# EAGLE design Seeeduino-Stalker-v3.0 (EAGLE 6.4)
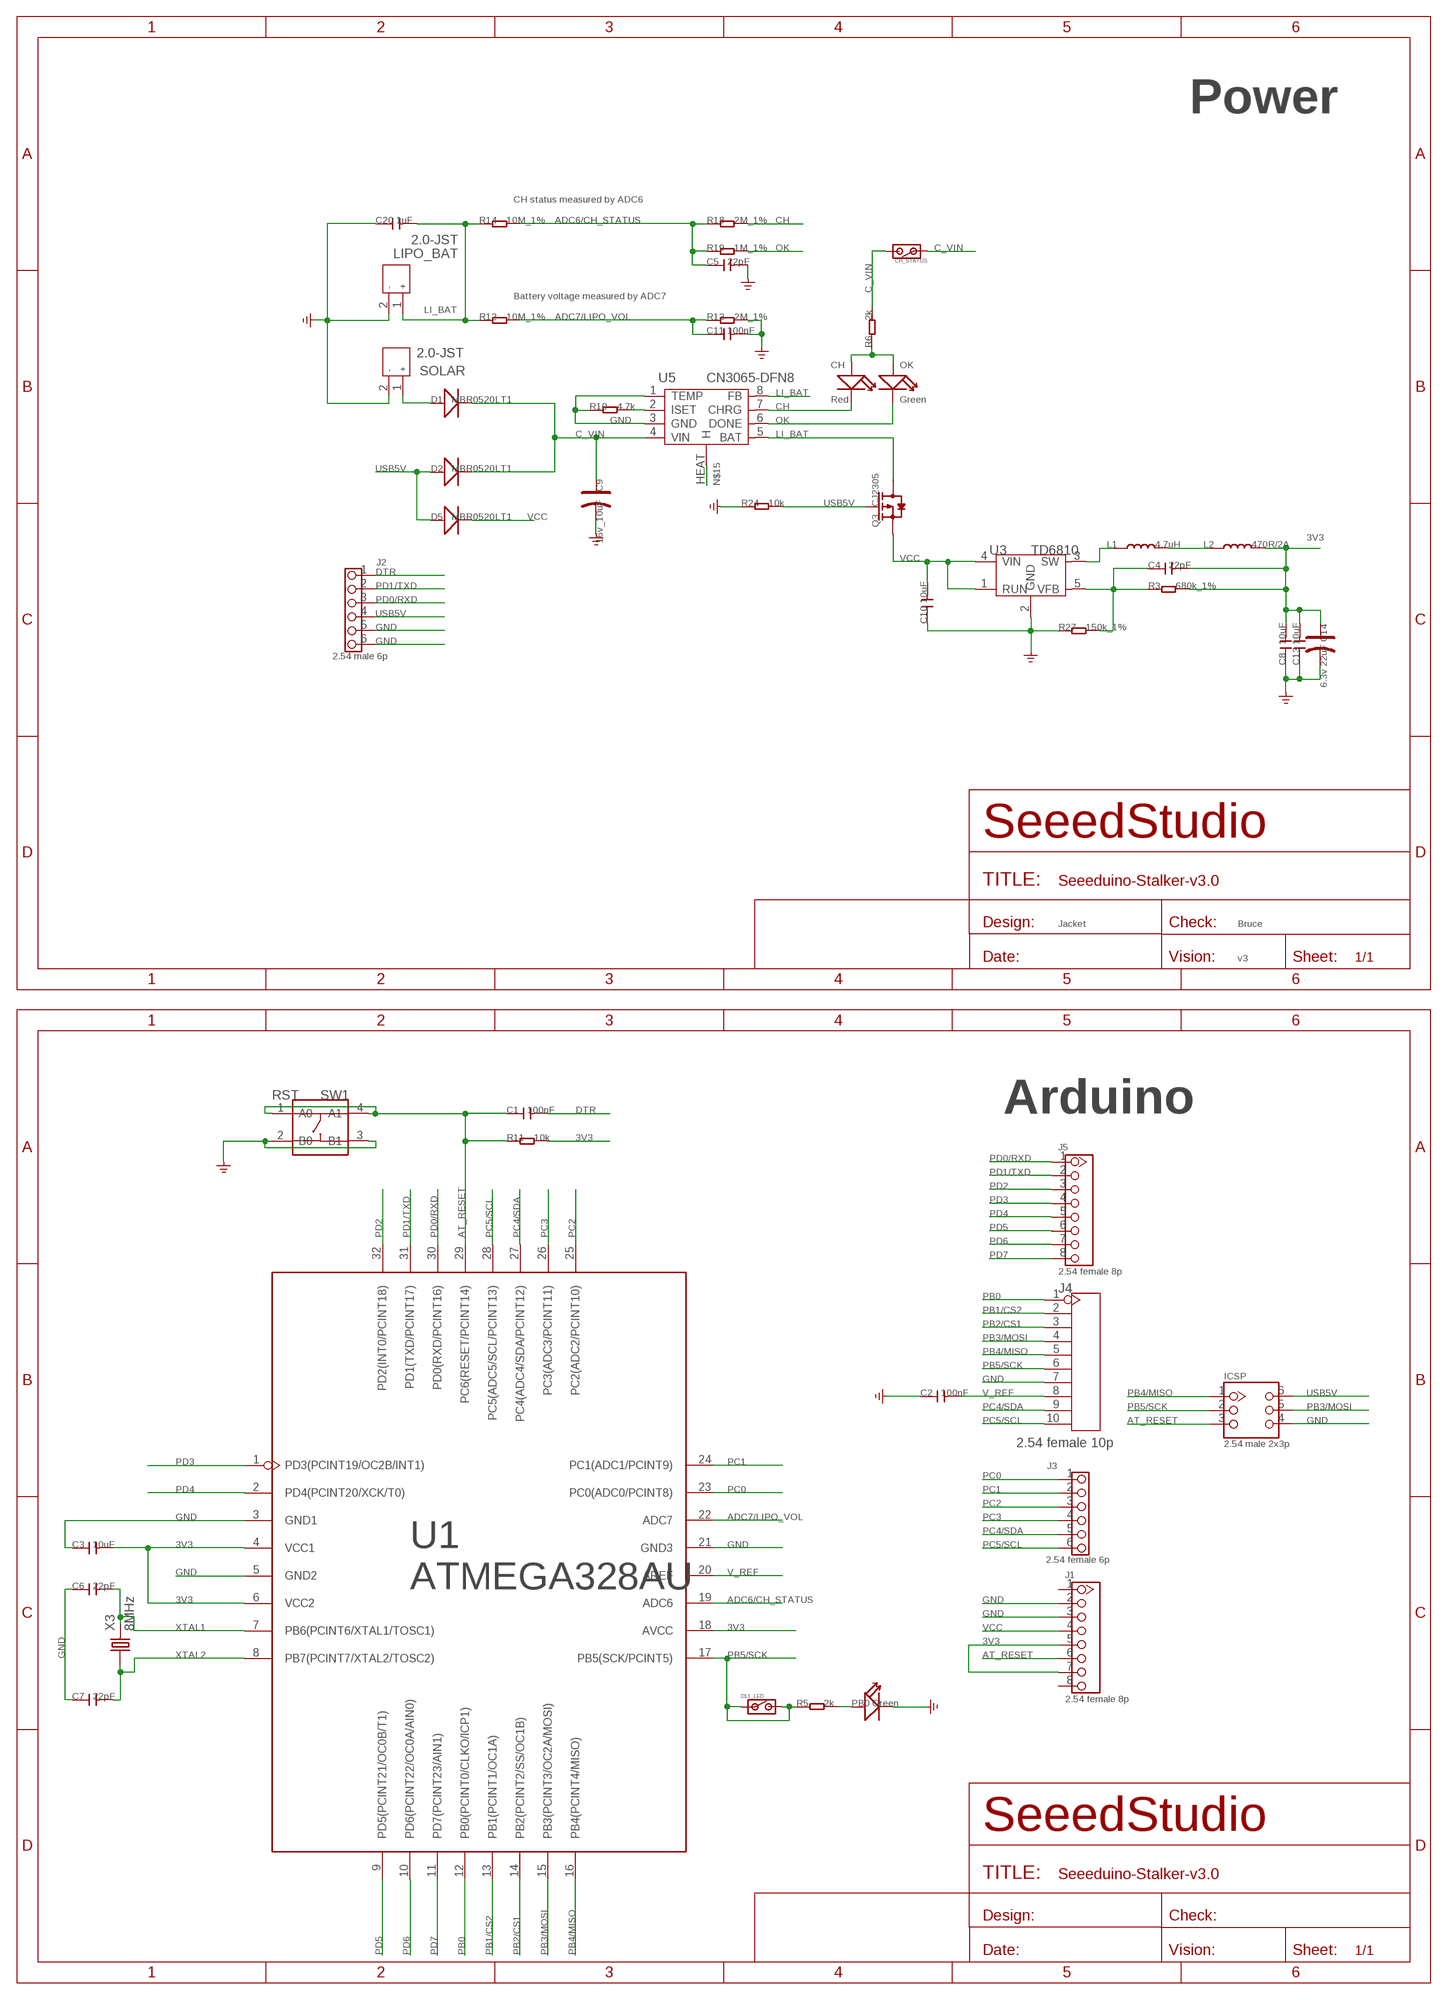
[diagram p0: schematic, sheet 1, part 1 of 2]
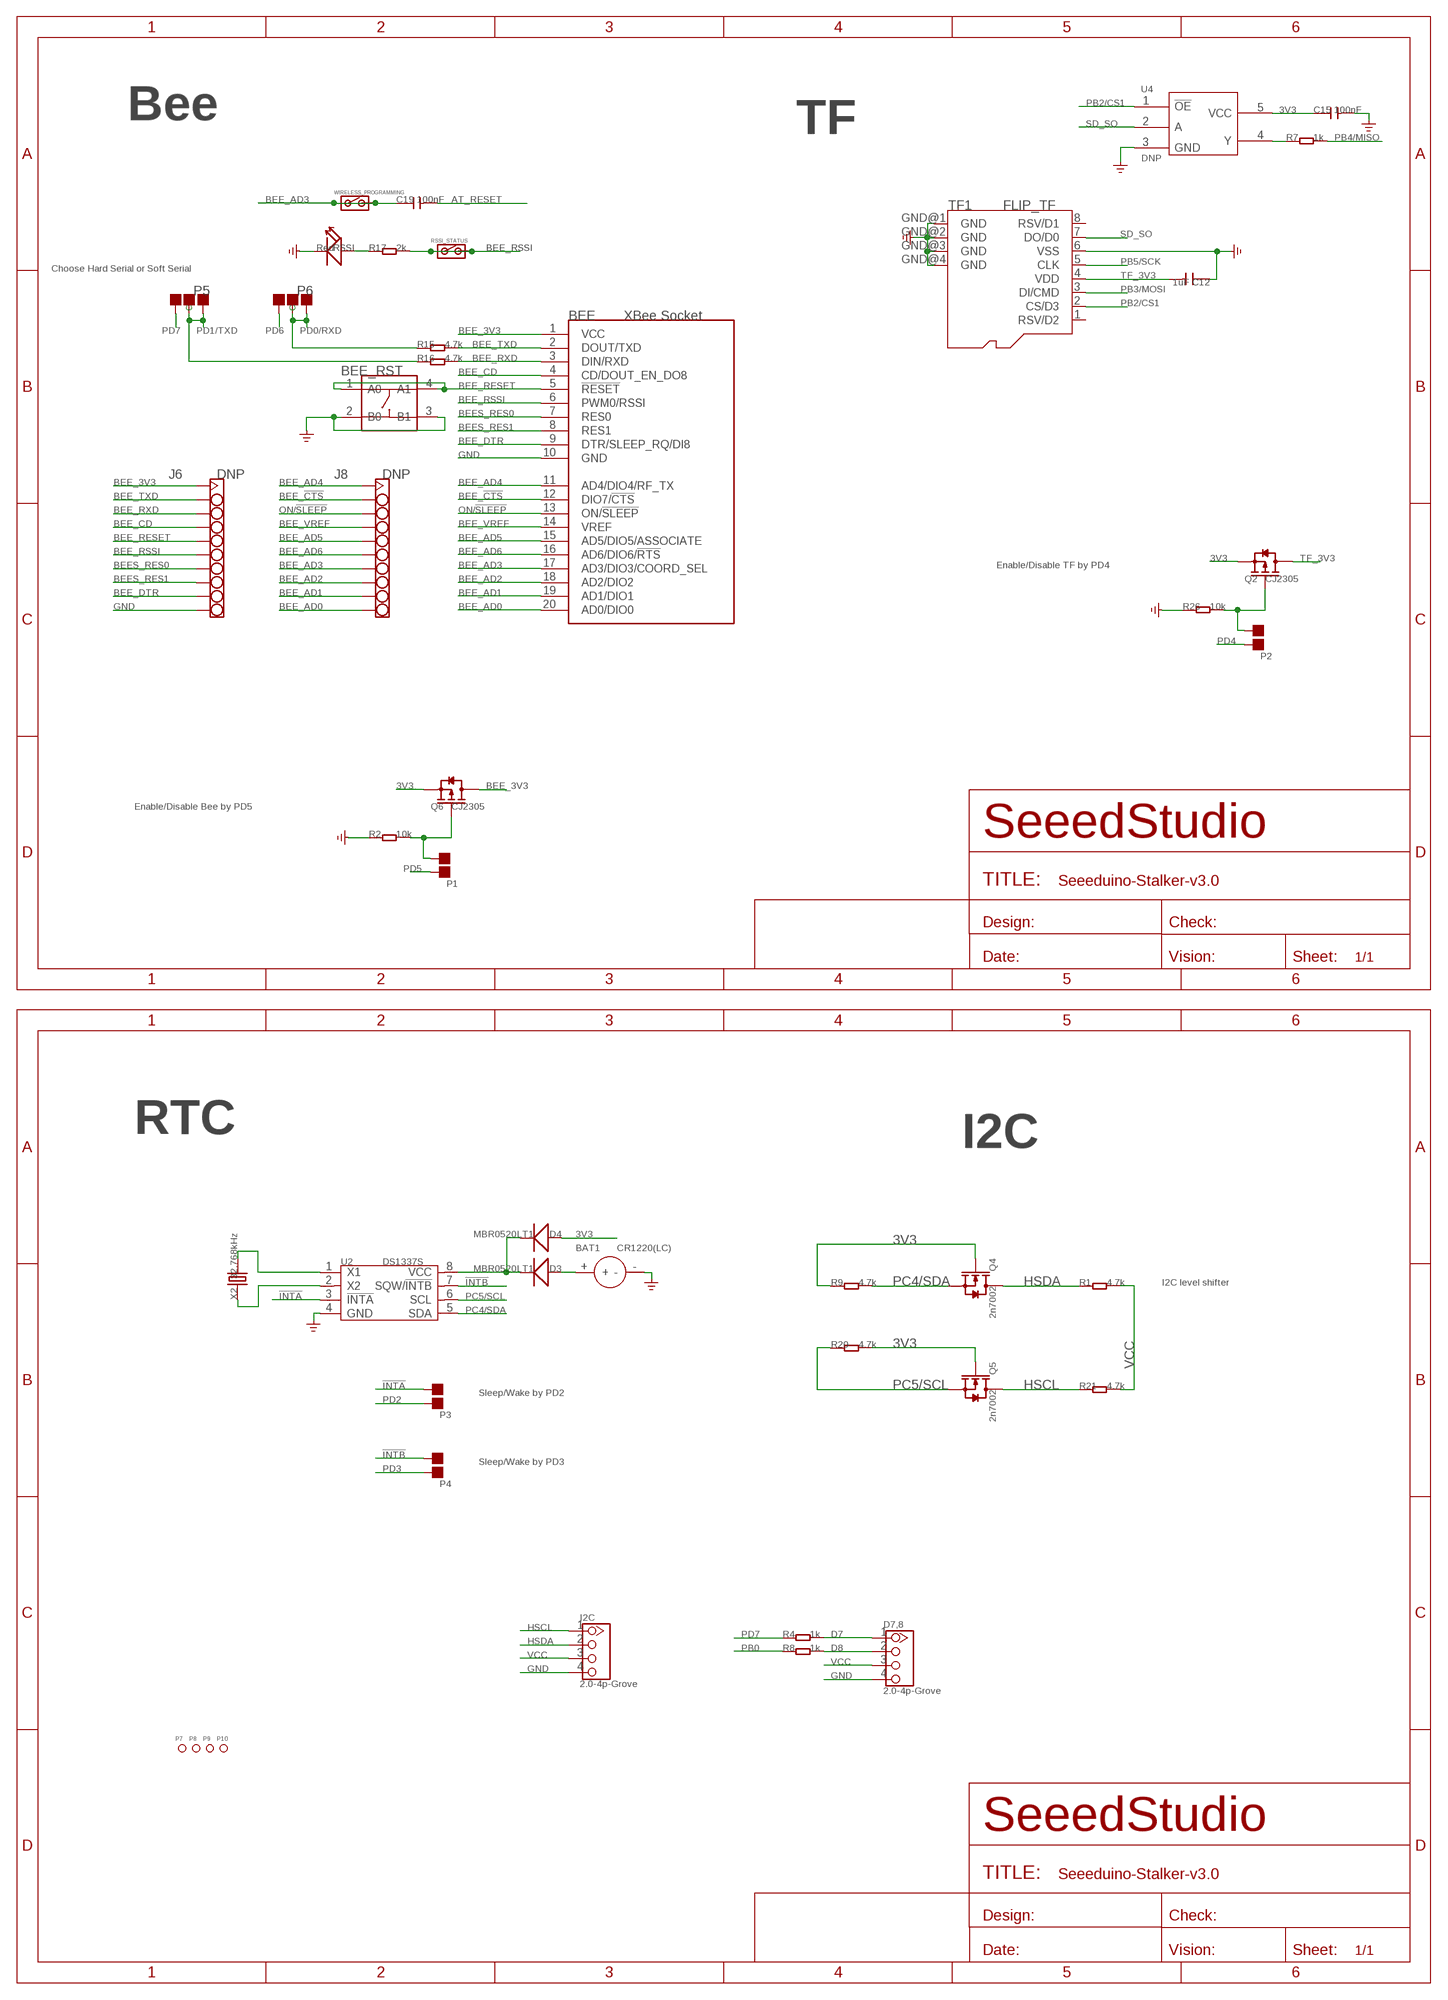
[diagram p1: schematic, sheet 1, part 2 of 2]

## Parts
BAT1  CR1220(LC)  BATTERY-3V  [2P-D12.55X2.22H]
BEE  XBee Socket  BEEO  [BEE]
BEE_RST  SW2  BUTTON-4P-6X6-SMD  [4P-SMD-6.2X6.2X4H]
C1  100nF  C-0603  [C0603]
C2  100nF  C-0603  [C0603]
C3  10uF  C-0805  [C0805]
C4  22pF  C-0603  [C0603]
C5  22pF  C-0603  [C0603]
C6  22pF  C-0603  [C0603]
C7  22pF  C-0603  [C0603]
C8  10uF  C-0805  [C0805]
C9  16v_10uF  CAP-AVX-A  [AVX-A]
C10  10uF  C-0805  [C0805]
C11  100nF  C-0603  [C0603]
C12  1uF  C-0805  [C0805]
C13  10uF  C-0805  [C0805]
C14  6.3v 22uF  CAP-AVX-A  [AVX-A]
C15  100nF  C-0603  [C0603]
C19  100nF  C-0603  [C0603]
C20  1uF  C-0805  [C0805]
CH  Red  007-LED0603  [D0603]
CH_STATUS  DNP  JP_SW  [JP_SW]
D1  MBR0520LT1  D'MBR0520LT1'  [SOD123-2.7X1.6]
D2  MBR0520LT1  D'MBR0520LT1'  [SOD123-2.7X1.6]
D3  MBR0520LT1  D'MBR0520LT1'  [SOD123-2.7X1.6]
D4  MBR0520LT1  D'MBR0520LT1'  [SOD123-2.7X1.6]
D5  MBR0520LT1  D'MBR0520LT1'  [SOD123-2.7X1.6]
D7,8  2.0-4p-Grove  TWIG-4P-2.0-2.0  [4P-2.0]
D13_LED  DNP  JP_SW  [JP_SW]
I2C  2.0-4p-Grove  TWIG-4P-2.0-2.0  [4P-2.0]
ICSP  2.54 male 2x3p  HEADER-2X3P-2.54  [2X3P-2.54-LEADED]
J1  2.54 female 8p  HEADER-8P-2.54-LEADED  [8P-2.54-LEADED]
J2  2.54 male 6p  HEADER-6P-LEADED-2.54  [6P-2.54-LEADED]
J3  2.54 female 6p  HEADER-6P-LEADED-2.54  [6P-2.54-LEADED]
J4  2.54 female 10p  HEADER-10P-2.54  [10P-2.54]
J5  2.54 female 8p  HEADER-8P-2.54-LEADED  [8P-2.54-LEADED]
J6  DNP  HEADER_1X10DD  [HEADER_1X10]
J8  DNP  HEADER_1X10DD  [HEADER_1X10]
L1  4.7uH  LSPD3D16-4R7M  [L0420]
L2  470R/2A  L'0805'  [L0805]
LIPO_BAT  2.0-JST  JACK-JST-2P-PW'2.0'  [JST-2.0]
OK  Green  007-LED0603  [D0603]
P1  DNP  PAD-JUMPER-2P  [2P-SMD-1.78X1.27]
P2  DNP  PAD-JUMPER-2P  [2P-SMD-1.78X1.27]
P3  DNP  PAD-JUMPER-2P  [2P-SMD-1.78X1.27]
P4  DNP  PAD-JUMPER-2P  [2P-SMD-1.78X1.27]
P5  DNP  PAD-JUMPER-3P-40*40  [3P-SMD-4.1X1.5]
P6  DNP  PAD-JUMPER-3P-40*40  [3P-SMD-4.1X1.5]
P7  PAD-MARK  [ROUND-MARK-1.0]
P8  PAD-MARK  [ROUND-MARK-1.0]
P9  PAD-MARK  [ROUND-MARK-1.0]
P10  PAD-MARK  [ROUND-MARK-1.0]
PB0  Green  007-LED0603  [D0603]
Q2  CJ2305  MOSFET-P'SI2323CDS/SI2305DS<BR>'  [SOT23]
Q3  CJ2305  MOSFET-P'SI2323CDS/SI2305DS<BR>'  [SOT23]
Q4  2n7002  MOSFET-N'SOT23'  [SOT23]
Q5  2n7002  MOSFET-N'SOT23'  [SOT23]
Q6  CJ2305  MOSFET-P'SI2323CDS/SI2305DS<BR>'  [SOT23]
R1  4.7k  005-R0603  [0603@1]
R2  10k  005-R0603  [0603@1]
R3  680k_1%  005-R0603  [0603@1]
R4  1k  005-R0603  [0603@1]
R5  2k  005-R0603  [0603@1]
R6  2k  005-R0603  [0603@1]
R7  1k  005-R0603  [0603@1]
R8  1k  005-R0603  [0603@1]
R9  4.7k  005-R0603  [0603@1]
R10  4.7k  005-R0603  [0603@1]
R11  10k  005-R0603  [0603@1]
R12  10M_1%  005-R0603  [0603@1]
R13  2M_1%  005-R0603  [0603@1]
R14  10M_1%  005-R0603  [0603@1]
R15  4.7k  005-R0603  [0603@1]
R16  4.7k  005-R0603  [0603@1]
R17  2k  005-R0603  [0603@1]
R18  2M_1%  005-R0603  [0603@1]
R19  1M_1%  005-R0603  [0603@1]
R20  4.7k  005-R0603  [0603@1]
R21  4.7k  005-R0603  [0603@1]
R24  10k  005-R0603  [0603@1]
R26  10k  005-R0603  [0603@1]
R27  150k_1%  005-R0603  [0603@1]
RSSI  Red  007-LED0603  [D0603]
RSSI_STATUS  DNP  JP_SW  [JP_SW]
RST  SW1  BUTTON-4P-6X6-SMD  [4P-SMD-6.2X6.2X4H]
SOLAR  2.0-JST  JACK-JST-2P-PW'2.0'  [JST-2.0]
TF1  FLIP_TF  [FLIP_TF]
U1  ATMEGA328AU  ATMEGA168-20AU  [ATMEGA168-20AU]
U2  DS1337S  [SOP8]
U3  TD6810  TD6810'TSOT23-5'  [SOT23-5]
U4  DNP  SN74LVC1G125DCKR  [SOT353]
U5  CN3065-DFN8  [DFN8]
WIRELESS_PROGRAMMING  DNP  JP_SW  [JP_SW]
X2  32.768kHz  CRYSTAL-3215  [2P-SMD-3.2X1.5]
X3  8MHz  011-CRYSTALHC49S  [HC49/S]

## Nets
3V3: C3.2 C4.2 C8.2 C13.2 C14.+ C15.1 D4.1(+) J1.5 J1.7 L2.2 Q2.2(S) Q4.1(G) Q5.1(G) Q6.2(S) R3.2 R9.1 R11.2 R20.2 U1.4(VCC1) U1.6(VCC2) U1.18(AVCC) U4.5(VCC)
!INTA: P3.1 U2.3(!INTA)
!INTB: P4.1 U2.7(SQW/!INTB)
ADC6/CH_STATUS: C5.1 R14.2 R18.1 R19.1 U1.19(ADC6)
ADC7/LIPO_VOL: C11.1 R12.2 R13.1 U1.22(ADC7)
AT_RESET: C1.1 C19.2 ICSP.3 J1.6 R11.1 RST.1(A0) RST.4(A1) U1.29(PC6(RESET/PCINT14))
BEE_3V3: BEE.1(VCC) J6.1 Q6.3(D)
BEE_!CTS: BEE.12(DIO7/!CTS) J8.2
BEE_AD0: BEE.20(AD0/DIO0) J8.10
BEE_AD1: BEE.19(AD1/DIO1) J8.9
BEE_AD2: BEE.18(AD2/DIO2) J8.8
BEE_AD3: BEE.17(AD3/DIO3/COORD_SEL) C19.1 J8.7 WIRELESS_PROGRAMMING.1 WIRELESS_PROGRAMMING.2
BEE_AD4: BEE.11(AD4/DIO4/RF_TX) J8.1
BEE_AD5: BEE.15(AD5/DIO5/ASSOCIATE) J8.5
BEE_AD6: BEE.16(AD6/DIO6/!RTS) J8.6
BEE_CD: BEE.4(CD/DOUT_EN_DO8) J6.4
BEE_DTR: BEE.9(DTR/SLEEP_RQ/DI8) J6.9
BEE_RESET: BEE.5(!RESET) BEE_RST.1(A0) BEE_RST.4(A1) J6.5
BEE_RSSI: BEE.6(PWM0/RSSI) J6.6 R17.2 RSSI_STATUS.1 RSSI_STATUS.2
BEE_RXD: BEE.3(DIN/RXD) J6.3 R16.2
BEE_TXD: BEE.2(DOUT/TXD) J6.2 R15.2
BEE_VREF: BEE.14(VREF) J8.4
BEES_RES0: BEE.7(RES0) J6.7
BEES_RES1: BEE.8(RES1) J6.8
C_VIN: C9.+ CH_STATUS.1 CH_STATUS.2 D1.2(-) D2.2(-) R6.2 U5.4(VIN)
CH: CH.- R18.2 U5.7(CHRG)
D7: D7,8.1 R4.2
D8: D7,8.2 R8.2
DTR: C1.2 J2.1
GND: BAT1.- BEE.10(GND) BEE_RST.2(B0) BEE_RST.3(B1) C2.1 C3.1 C5.2 C6.1 C7.1 C8.1 C9.- C10.1 C11.2 C12.1 C13.1 C14.- C15.2 C20.1 D7,8.4 I2C.4 ICSP.4 J1.2 J1.3 J2.5 J2.6 J4.7 J6.10 LIPO_BAT.2 PB0.- R2.1 R10.1 R13.2 R24.1 R26.1 R27.1 RSSI.- RST.2(B0) RST.3(B1) SOLAR.2 TF1.6(VSS) TF1.GND@1(GND) TF1.GND@2(GND) TF1.GND@3(GND) TF1.GND@4(GND) U1.3(GND1) U1.5(GND2) U1.21(GND3) U2.4(GND) U3.2(GND) U4.3(GND) U5.1(TEMP) U5.3(GND)
HSCL: I2C.1 Q5.3(D) R21.1
HSDA: I2C.2 Q4.3(D) R1.1
LI_BAT: C20.2 LIPO_BAT.1 Q3.3(D) R12.1 R14.1 U5.5(BAT) U5.8(FB)
N$1: PB0.+ R5.2
N$2: D3.2(-) D4.2(-) U2.8(VCC)
N$3: D1.1(+) SOLAR.1
N$4: BAT1.+ D3.1(+)
N$5: R10.2 U5.2(ISET)
N$6: R17.1 RSSI.+
N$7: U2.1(X1) X2.2
N$8: CH.+ OK.+ R6.1
N$9: U2.2(X2) X2.1
N$13: C4.1 R3.1 R27.2 U3.5(VFB)
N$14: P1.1 Q6.1(G) R2.2
N$15: U5.HEAT(H)
N$16: P2.1 Q2.1(G) R26.2
N$17: L1.2 L2.1
N$18: L1.1 U3.3(SW)
N$19: R7.1 U4.4(Y)
OK: OK.- R19.2 U5.6(DONE)
ON/!SLEEP: BEE.13(ON/!SLEEP) J8.3
PB0: J4.1 R8.1 U1.12(PB0(PCINT0/CLKO/ICP1))
PB1/CS2: J4.2 U1.13(PB1(PCINT1/OC1A))
PB2/CS1: J4.3 TF1.2(CS/D3) U1.14(PB2(PCINT2/SS/OC1B)) U4.1(!OE!)
PB3/MOSI: ICSP.5 J4.4 TF1.3(DI/CMD) U1.15(PB3(PCINT3/OC2A/MOSI))
PB4/MISO: ICSP.1 J4.5 R7.2 U1.16(PB4(PCINT4/MISO))
PB5/SCK: D13_LED.1 D13_LED.2 ICSP.2 J4.6 R5.1 TF1.5(CLK) U1.17(PB5(SCK/PCINT5))
PC0: J3.1 U1.23(PC0(ADC0/PCINT8))
PC1: J3.2 U1.24(PC1(ADC1/PCINT9))
PC2: J3.3 U1.25(PC2(ADC2/PCINT10))
PC3: J3.4 U1.26(PC3(ADC3/PCINT11))
PC4/SDA: J3.5 J4.9 Q4.2(S) R9.2 U1.27(PC4(ADC4/SDA/PCINT12)) U2.5(SDA)
PC5/SCL: J3.6 J4.10 Q5.2(S) R20.1 U1.28(PC5(ADC5/SCL/PCINT13)) U2.6(SCL)
PD0/RXD: J2.3 J5.1 P6.11(R) P6.MM(C) R15.1 U1.30(PD0(RXD/PCINT16))
PD1/TXD: J2.2 J5.2 P5.11(R) P5.MM(C) R16.1 U1.31(PD1(TXD/PCINT17))
PD2: J5.3 P3.2 U1.32(PD2(INT0/PCINT18))
PD3: J5.4 P4.2 U1.1(PD3(PCINT19/OC2B/INT1))
PD4: J5.5 P2.2 U1.2(PD4(PCINT20/XCK/T0))
PD5: J5.6 P1.2 U1.9(PD5(PCINT21/OC0B/T1))
PD6: J5.7 P6.00(L) U1.10(PD6(PCINT22/OC0A/AIN0))
PD7: J5.8 P5.00(L) R4.1 U1.11(PD7(PCINT23/AIN1))
SD_SO: TF1.7(DO/D0) U4.2(A)
TF_3V3: C12.2 Q2.3(D) TF1.4(VDD)
USB5V: D2.1(+) D5.1(+) ICSP.6 J2.4 Q3.1(G) R24.2
V_REF: C2.2 J4.8 U1.20(AREF)
VCC: C10.2 D5.2(-) D7,8.3 I2C.3 J1.4 Q3.2(S) R1.2 R21.2 U3.1(RUN) U3.4(VIN)
XTAL1: C6.2 U1.7(PB6(PCINT6/XTAL1/TOSC1)) X3.2
XTAL2: C7.2 U1.8(PB7(PCINT7/XTAL2/TOSC2)) X3.1
Unconnected: J1.1 J1.8 TF1.1(RSV/D2) TF1.8(RSV/D1)

## Notes on the sheet
- Power | Bee
- TF
- CH status measured by ADC6
- Choose Hard Serial or Soft Serial
- Battery voltage measured by ADC7
- Enable/Disable TF by PD4
- Enable/Disable Bee by PD5
- Jacket | Bruce
- v3
- Arduino
- RTC | I2C
- I2C level shifter
- Sleep/Wake by PD2
- Sleep/Wake by PD3

## Library data of the parts
BAT1 = dwin:BATTERY-3V
BEE = EXT_moudle:BEE
BEE_RST RST = Discrete:BUTTON-4P
C1-C8 C10-C13 C15 C19 C20 = Discrete:C*: Ceramic Capacitors
C9 C14 = Discrete:CAP*: Electrolytic Capacitors,Tantalum Capacitors and Super Capacitors
CH OK PB0 RSSI = Discrete:007-LED*
CH_STATUS D13_LED RSSI_STATUS WIRELESS_PROGRAMMING = CPT_SMD:JP_SW
D1-D5 = Discrete:D*
D7,8 I2C = Connector:TWIG-4P-2.0
ICSP = Connector:HEADER-2X3P
J1 J5 = Connector:HEADER-8P
J2 J3 = Connector:HEADER-6P
J4 = Connector :HEADER-10P
J6 J8 = CONNECTER:HEADER_1X10
L1 = template:L
L2 = Discrete:L*
LIPO_BAT SOLAR = Connector:JACK-JST-2P-PW
P1-P4 = Discrete:PAD-JUMPER-2P; PARTNO: DNP
P5 P6 = Discrete:PAD-JUMPER-3P; PARTNO: DNP
P7-P10 = Discrete:PAD-MARK; PARTNO: DNP
Q2 Q3 Q6 = Discrete:MOSFET-P
Q4 Q5 = Discrete:MOSFET-N: IRLL014: http://www.vishay.com/docs/91319/sihll014.pdf
R1-R21 R24 R26 R27 = Discrete:005-R*
TF1 = Holders:FLIP_TF: http://garden.seeedstudio.com/images/e/e4/Flip_TF_Holder.jpg
U1 = IC_SMD:ATMEGA168-20AU
U2 = AMLib:DS1337: I2C Serial Real-Time clock http://datasheets.maximintegrated.com/en/ds/DS1337-DS1337C.pdf
U3 = IC:TD6810: 1.5MHz 800mA Synchronous Step-Down Regulator Dropout http://www.techcodeok.com/download/TD6810.pdf
U4 = Test:SN74LVC1G125DCKR: Signal bus buffer gate
U5 = IC:CN3065: USB-Compatible Lithiumt-Ion Battery Charger with Thermal Regulation http://www.consonance-elec.com/pdf/%E6%8A%80%E6%9C%AF%E8%AF%B4%E6%98%8E%E4%B9%A6/DSC-CN3065.pdf
X2 = Discrete:CRYSTAL*: CRYSTAL
X3 = Discrete:011-CRYSTAL*: CRYSTAL

## Net classes
0 default: width 0.203 mm, drill 0.305 mm, clearance 0.152 mm

## Board
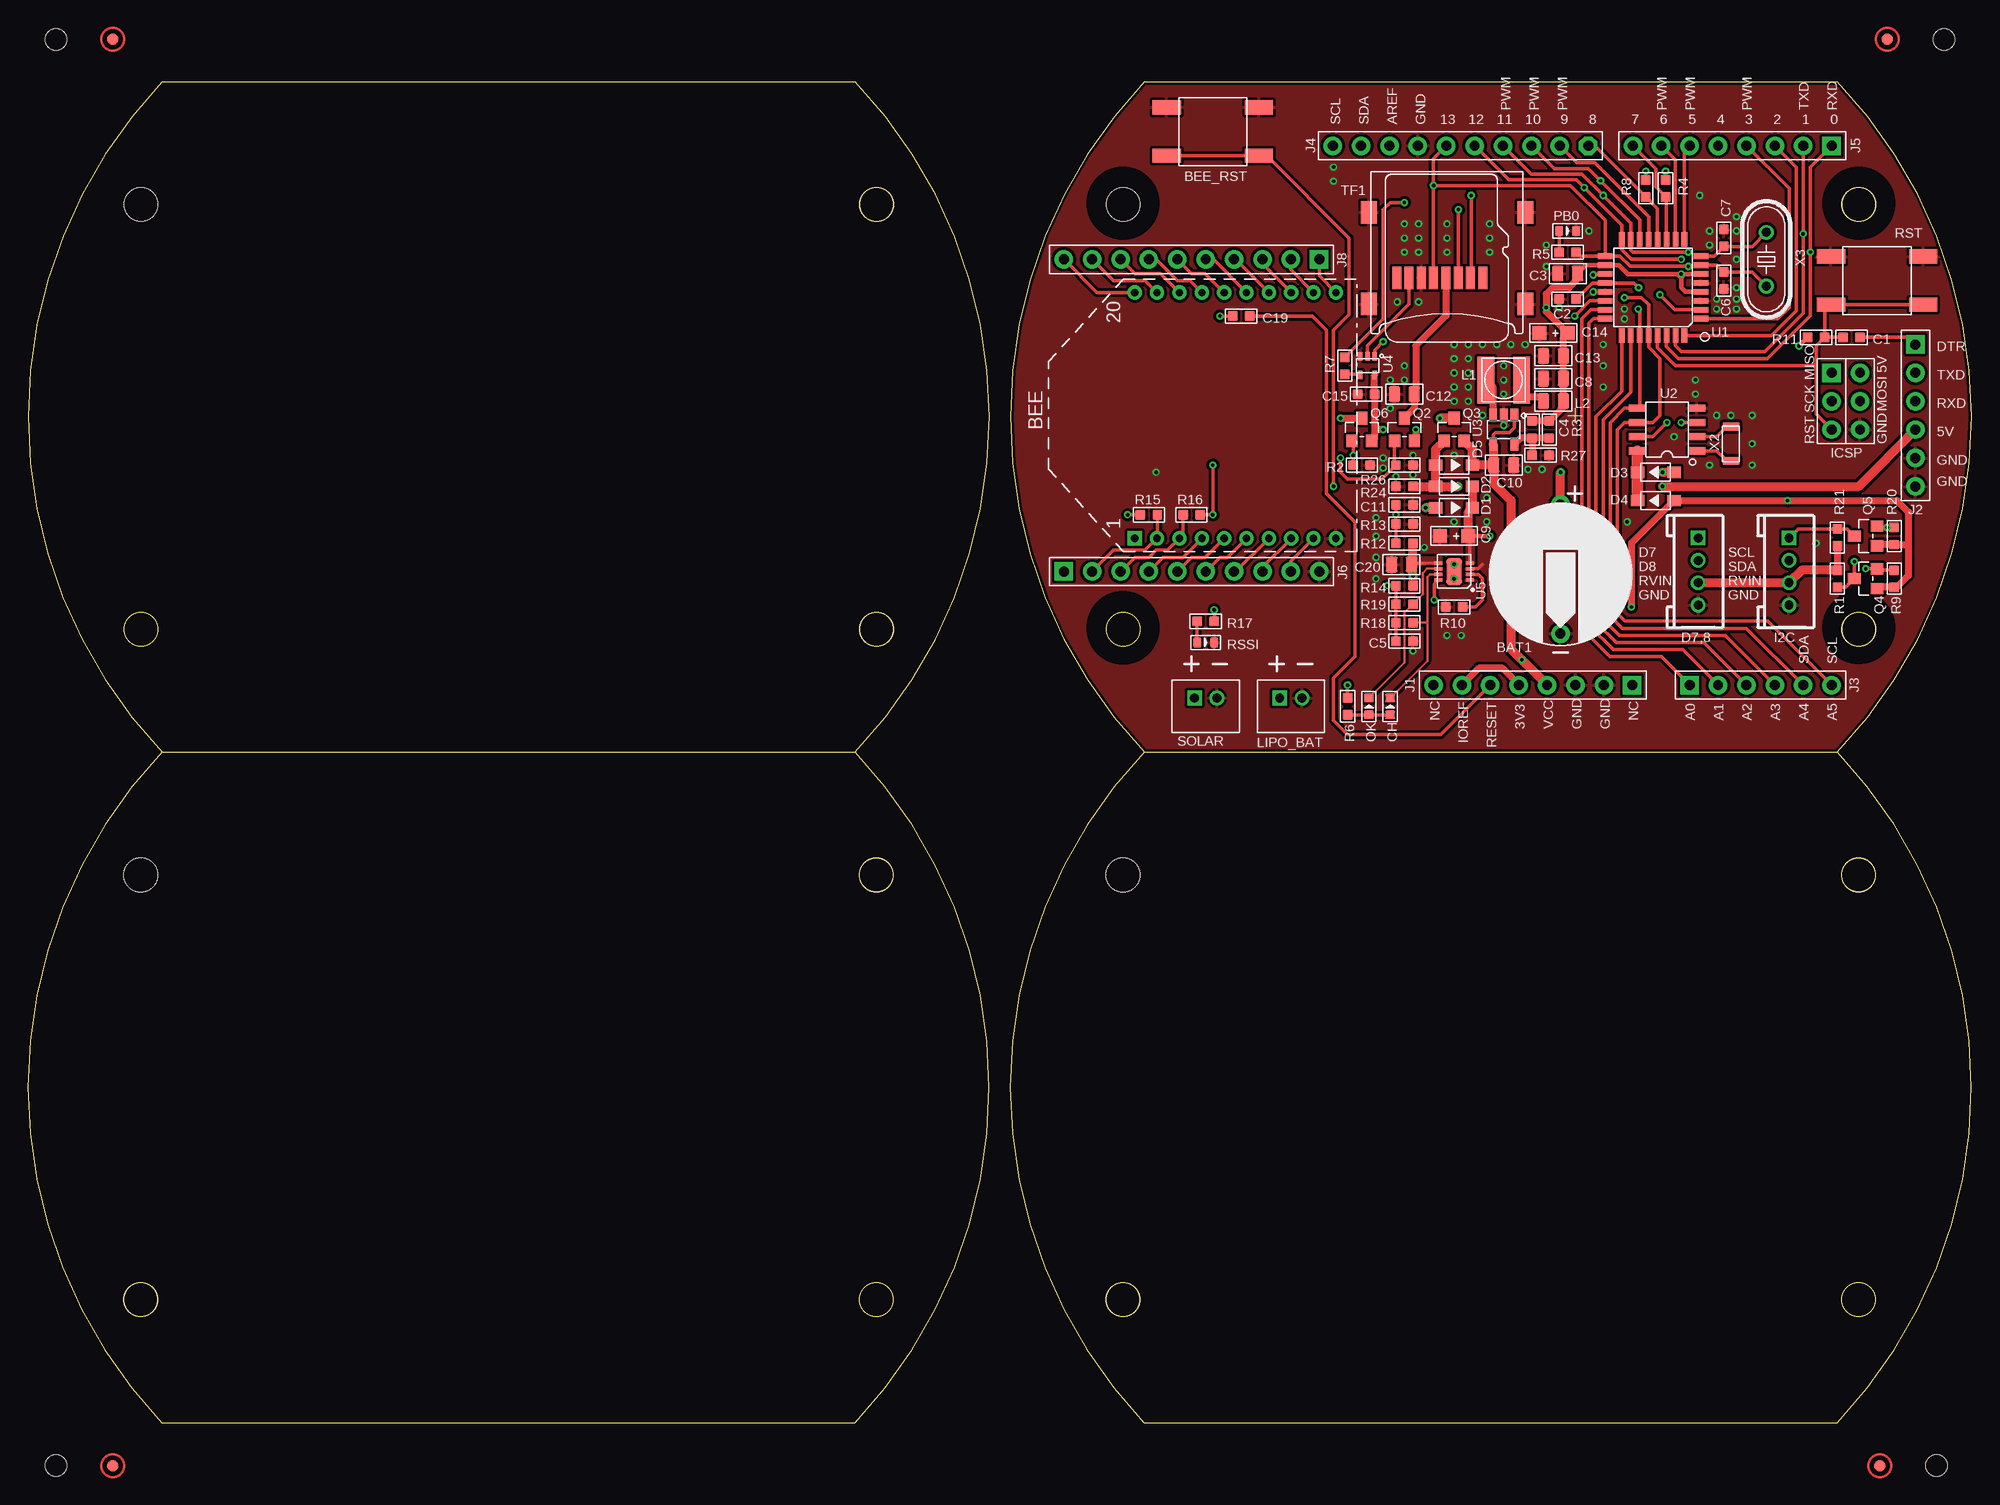
[diagram p2: board, top side]
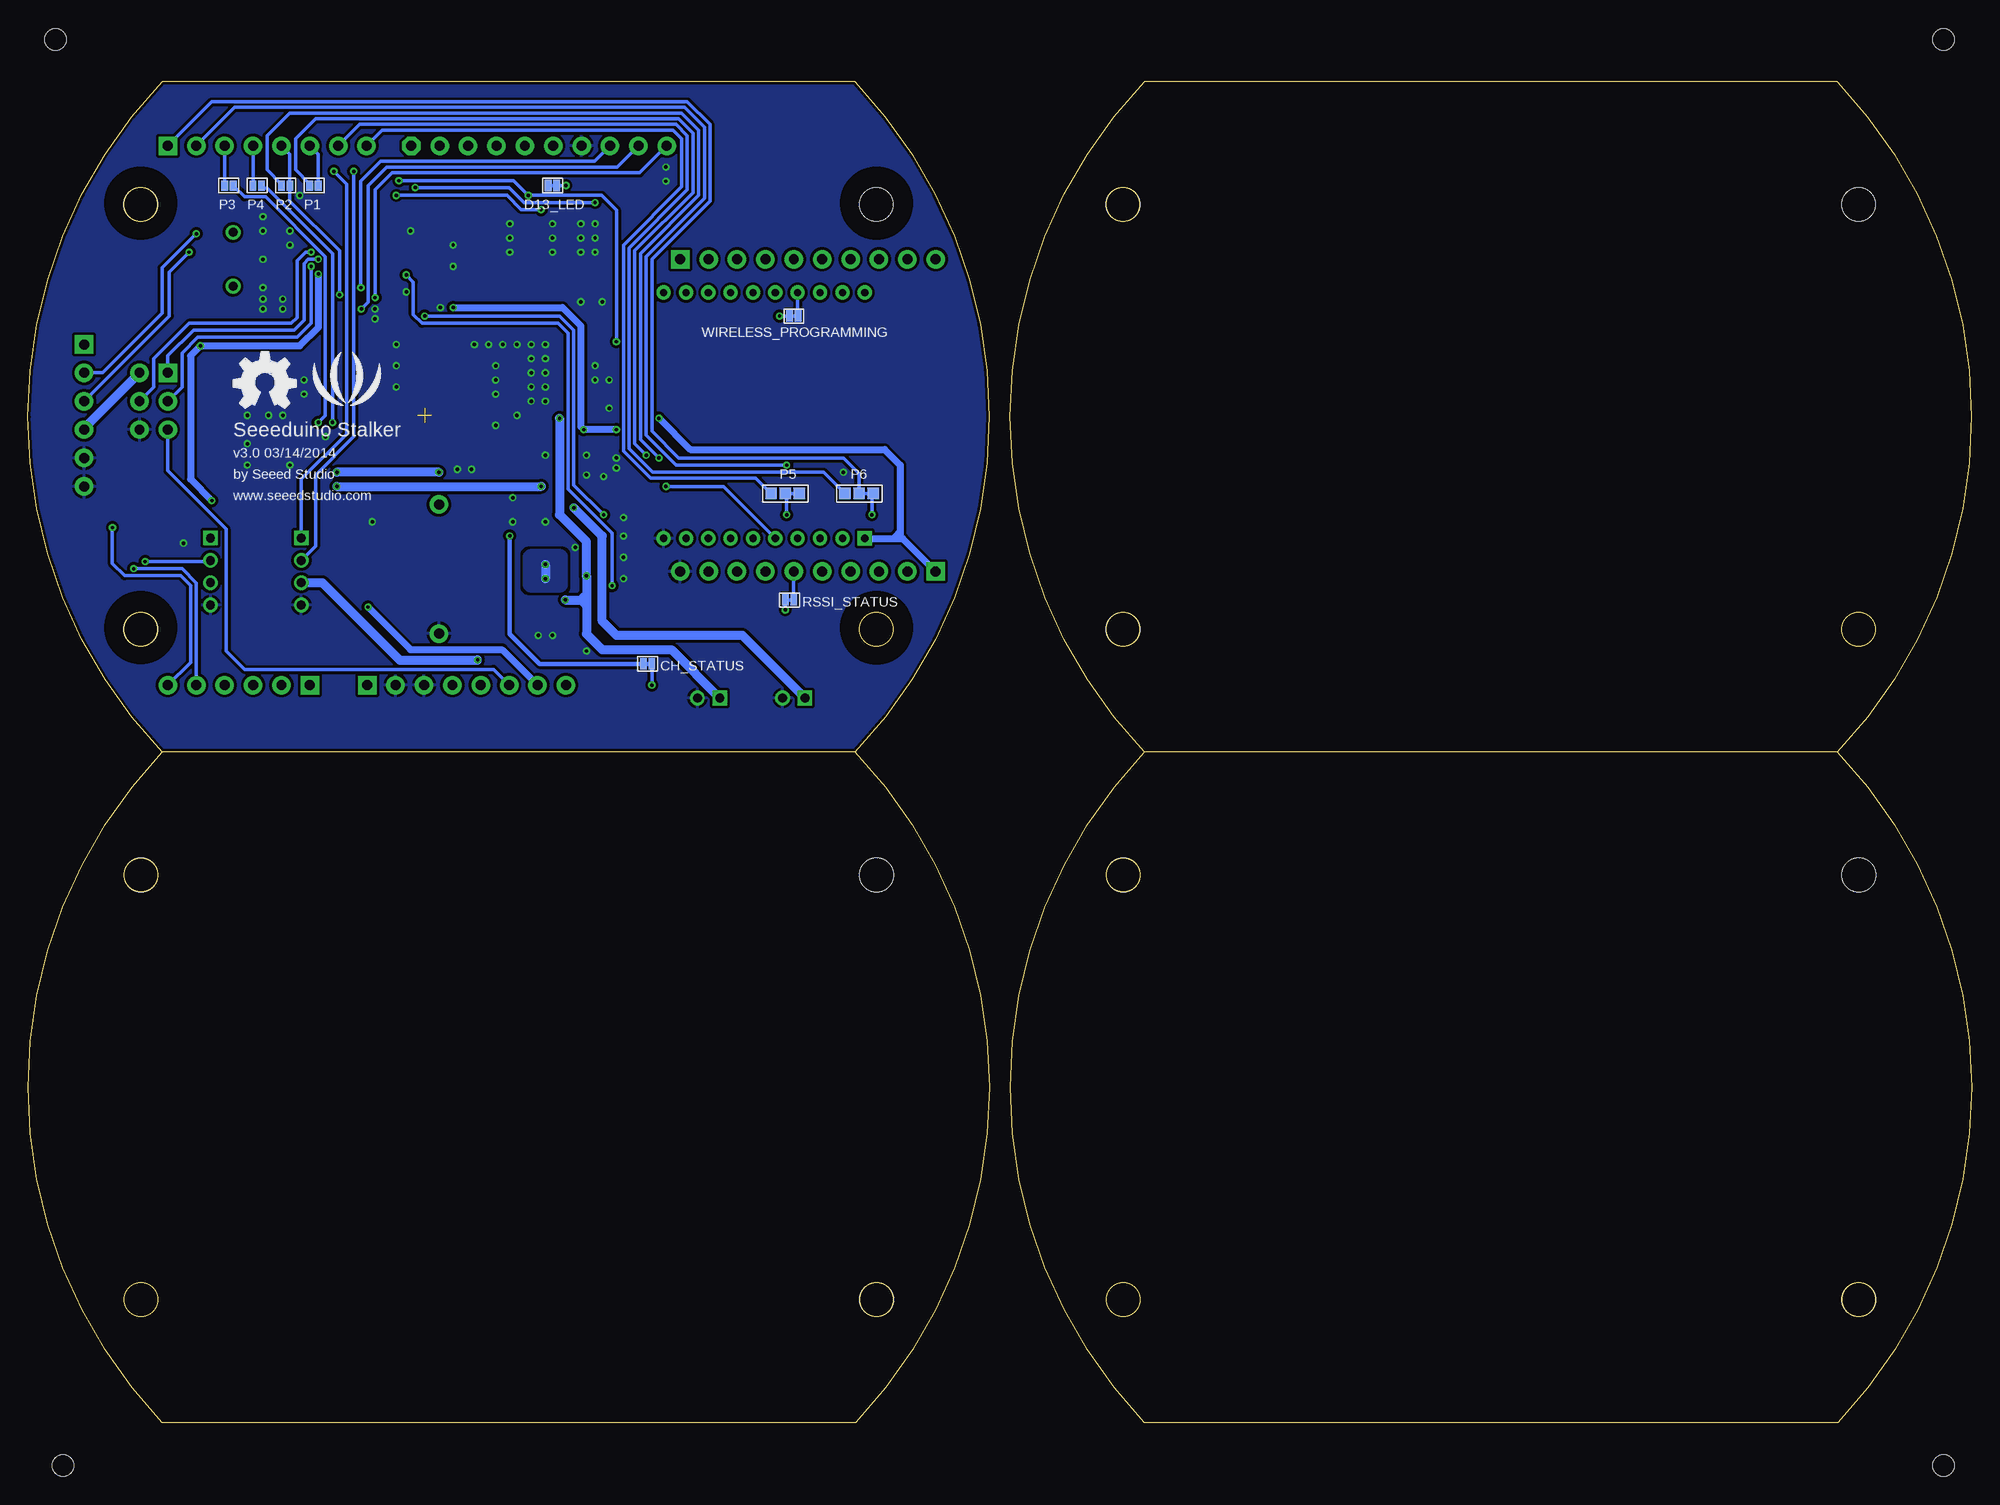
[diagram p3: board, bottom side, seen from below]

Size 173.9 x 120 mm. Coordinates in mm from the lower left corner, seen from the top.
Outline: 99.92,120 161.9,120 arc-87 161.9,60 99.89,60
Outline: 99.92,120 arc87 99.89,60
Outline: 99.9,60 161.88,60 arc-87 161.88,0 99.87,0
Outline: 99.9,60 arc87 99.87,0
Outline: 12.03,120 74.02,120 arc-87 74.02,60 12.01,60
Outline: 12.03,120 arc87 12,60
Outline: 12.01,60 74,60 arc-87 74,0 11.99,0
Outline: 12.01,60 arc87 11.99,0
Outline: circle at 163.81,109 radius 1.5
Outline: circle at 163.81,71 radius 1.5
Outline: circle at 97.99,71 radius 1.5
Outline: circle at 163.8,49 radius 1.5
Outline: circle at 163.8,11 radius 1.5
Outline: circle at 97.97,11 radius 1.5
Outline: circle at 75.93,109 radius 1.5
Outline: circle at 75.93,71 radius 1.5
Outline: circle at 10.11,71 radius 1.5
Outline: circle at 75.91,49 radius 1.5
Outline: circle at 75.91,11 radius 1.5
Outline: circle at 10.09,11 radius 1.5
Copper layers (1*16): Top 0.035mm / dielectric 1.5mm / Bottom 0.035mm
Design rules "default": minimum track width 6mil, minimum drill 12mil, track to track 6mil, track to pad 6mil, pad to pad 6mil, via to via 6mil, smd to smd 0mil, copper to edge 10mil, drill to drill 10mil, minimum pad ring 10mil, minimum via ring 6mil, stop-mask expansion 2mil, vias tented up to drill 25mil, thermal gap 10mil
Holes 3 mm at 97.99,109 163.82,109 163.82,71 97.99,71 97.97,49 163.8,49 163.8,11 97.97,11 10.11,109 75.93,109 75.93,71 10.11,71 10.09,49 75.91,49 75.91,11 10.09,11
Holes 1.91 mm at 2.51,123.78 171.42,123.78 170.78,-3.85 2.51,-3.85
tRestrict: area 95,106.1 to 101,112.1; area 95,68.1 to 101,74.1; area 160.8,68.1 to 166.8,74.1; area 160.8,106.1 to 166.8,112.1
bRestrict: area 95,106.1 to 101,112.1; area 95,68.1 to 101,74.1; area 160.8,68.1 to 166.8,74.1; area 160.8,106.1 to 166.8,112.1
Milling: 2 lines

### Footprints (pad centres in the part's own frame; a part is rotated, then mirrored left to right if it is on the bottom)
2P-D12.55X2.22H = drill 0.889 pad 1.651: + -6.25,0; - 5.3,0
BEE = drill 0.635 pad 1.27 square: 1 -11,0 | drill 0.635 pad 1.27: 2 -11,-2; 3 -11,-4; 4 -11,-6; 5 -11,-8; 6 -11,-10; 7 -11,-12; 8 -11,-14; 9 -11,-16; 10 -11,-18; 11 11,-18; 12 11,-16; 13 11,-14; 14 11,-12; 15 11,-10; 16 11,-8; 17 11,-6; 18 11,-4; 19 11,-2; 20 11,0
4P-SMD-6.2X6.2X4H = smd 2.54 x 1.27: 1 -4.129,2.159; 2 -4.129,-2.159; 3 4.129,-2.159; 4 4.129,2.159
C0603 = smd 0.889 x 0.889: 1 -0.762,0; 2 0.762,0
C0805 = smd 1.016 x 1.397: 1 -0.889,0; 2 0.889,0
AVX-A = smd 1.27 x 1.27: + -1.27,0; - 1.27,0
D0603 = smd 0.762 x 0.889: + -0.762,0; - 0.762,0
JP_SW = smd 1.016 x 0.61: 1 0,0.381; 2 0,-0.381
SOD123-2.7X1.6 = smd 1.2 x 1.02: 1 -1.635,0; 2 1.635,0
4P-2.0 = drill 0.8 pad 1.27 square: 1 -3,0 | drill 0.8 pad 1.27: 2 -1,0; 3 1,0; 4 3,0
2X3P-2.54-LEADED = drill 0.889 pad 1.651 square: 1 -1.27,2.54 | drill 0.889 pad 1.651: 2 -1.27,0; 3 -1.27,-2.54; 4 1.27,-2.54; 5 1.27,0; 6 1.27,2.54
8P-2.54-LEADED = drill 0.889 pad 1.651 square: 1 0,8.89 | drill 0.889 pad 1.651: 2 0,6.35; 3 0,3.81; 4 0,1.27; 5 0,-1.27; 6 0,-3.81; 7 0,-6.35; 8 0,-8.89
6P-2.54-LEADED = drill 0.889 pad 1.651 square: 1 0,6.35 | drill 0.889 pad 1.651: 2 0,3.81; 3 0,1.27; 4 0,-1.27; 5 0,-3.81; 6 0,-6.35
10P-2.54 = drill 0.889 pad 1.651 octagon: 1 0,11.43 | drill 0.889 pad 1.651: 2 0,8.89; 3 0,6.35; 4 0,3.81; 5 0,1.27; 6 0,-1.27; 7 0,-3.81; 8 0,-6.35; 9 0,-8.89; 10 0,-11.43
HEADER_1X10 = drill 0.889 pad 1.651 square: 1 0,11.43 | drill 0.889 pad 1.651: 2 0,8.89; 3 0,6.35; 4 0,3.81; 5 0,1.27; 6 0,-1.27; 7 0,-3.81; 8 0,-6.35; 9 0,-8.89; 10 0,-11.43
L0420 = smd 1.5 x 4.2: 1 -1.6,0; 2 1.6,0
L0805 = smd 1.016 x 1.397: 1 -0.889,0; 2 0.889,0
JST-2.0 = drill 0.8 pad 1.3 square: 1 -1,0.75 | drill 0.8 pad 1.3: 2 1,0.75
2P-SMD-1.78X1.27 = smd 0.889 x 0.61: 1 0,0.381; 2 0,-0.381
3P-SMD-4.1X1.5 = smd 1.016 x 1.016: 00 -1.27,0; 11 1.27,0; MM 0,0
ROUND-MARK-1.0 = smd 1.016 x 1.016: P$1 0,0
SOT23 = smd 1.016 x 1.143: 1 -0.889,-1.016; 2 0.889,-1.016; 3 0,1.016
0603@1 = smd 0.889 x 0.889: 1 -0.762,0; 2 0.762,0
FLIP_TF = smd 0.8 x 2: 1 3.2,0.25; 2 2.1,0.25; 3 1,0.25; 4 -0.1,0.25; 5 -1.2,0.25; 6 -2.3,0.25; 7 -3.4,0.25; 8 -4.5,0.25 | smd 1.45 x 2: GND@1 -7,6.1; GND@2 -7,-2.1; GND@3 7,-2.1; GND@4 7,6.1
ATMEGA168-20AU = smd 1.27 x 0.508: 1 -4.293,2.8; 2 -4.293,2; 3 -4.293,1.2; 4 -4.293,0.4; 5 -4.293,-0.4; 6 -4.293,-1.2; 7 -4.293,-2; 8 -4.293,-2.8; 17 4.293,-2.8; 18 4.293,-2; 19 4.293,-1.2; 20 4.293,-0.4; 21 4.293,0.4; 22 4.293,1.2; 23 4.293,2; 24 4.293,2.8 | smd 0.508 x 1.27: 9 -2.8,-4.293; 10 -2,-4.293; 11 -1.2,-4.293; 12 -0.4,-4.293; 13 0.4,-4.293; 14 1.2,-4.293; 15 2,-4.293; 16 2.8,-4.293; 25 2.8,4.293; 26 2,4.293; 27 1.2,4.293; 28 0.4,4.293; 29 -0.4,4.293; 30 -1.2,4.293; 31 -2,4.293; 32 -2.8,4.293
SOP8 = smd 0.635 x 1.524: 1 -1.905,-2.667; 2 -0.635,-2.667; 3 0.635,-2.667; 4 1.905,-2.667; 5 1.905,2.667; 6 0.635,2.667; 7 -0.635,2.667; 8 -1.905,2.667
SOT23-5 = smd 0.69 x 1.2: 1 -0.95,-1.3; 2 0,-1.3; 3 0.95,-1.3; 4 0.95,1.3; 5 -0.95,1.3
SOT353 = smd 0.4 x 0.75: 1 -0.65,-0.825; 2 0,-0.825; 3 0.65,-0.825; 4 0.65,0.825; 5 -0.65,0.825
DFN8 = smd 0.3 x 0.727: 1 -0.75,-1.413; 2 -0.25,-1.413; 3 0.25,-1.413; 4 0.75,-1.413; 5 0.75,1.413; 6 0.25,1.413; 7 -0.25,1.413; 8 -0.75,1.413 | smd 2.413 x 1.397: HEAT 0,0
2P-SMD-3.2X1.5 = smd 0.762 x 1.524: 1 -1.524,0; 2 1.524,0
HC49/S = drill 0.813: 1 -2.413,0; 2 2.413,0

### Placement (x,y rotation side)
BAT1  137.13,75.9 270 top
BEE  99.03,90.13 90 top
BEE_RST  106.01,115.53 180 top
C1  163.16,97.11 0 top
C2  137.76,100.54 0 top
C3  137.76,102.83 0 top
C4  134.59,88.86 90 top
C5  123.16,69.93 0 top
C6  151.73,102.19 90 top
C7  151.73,106 270 top
C8  136.49,93.43 0 top
C9  127.6,79.33 180 top
C10  132.05,85.68 180 top
C11  123.16,82.13 0 top
C12  123.16,92.03 0 top
C13  136.49,95.46 0 top
C14  136.49,97.49 180 top
C15  119.73,92.03 180 top
C19  108.55,99.02 0 top
C20  122.91,76.79 0 top
CH  121.89,64.09 90 top
CH_STATUS  118.46,67.9 270 bottom
D1  127.6,81.87 0 top
D2  127.6,83.78 0 top
D3  145.64,85.05 180 top
D4  145.64,82.51 180 top
D5  127.6,85.68 0 top
D7,8  149.44,76.16 270 top
D13_LED  126.97,110.7 270 bottom
I2C  157.57,76.16 270 top
ICSP  162.65,91.4 0 top
J1  134.66,66 270 top
J2  168.88,90.13 0 top
J3  155.03,66 90 top
J4  128.17,114.26 270 top
J5  152.49,114.26 270 top
J6  104.11,76.16 90 top
J8  104.11,104.1 270 top
L1  132.05,93.3 0 top
L2  136.49,91.4 0 top
LIPO_BAT  113,64.09 0 top
OK  119.98,64.09 90 top
P1  148.31,110.7 90 bottom
P2  150.85,110.7 90 bottom
P3  155.93,110.7 270 bottom
P4  153.39,110.7 270 bottom
P5  106.14,83.14 0 bottom
P6  99.54,83.14 0 bottom
P7  7.59,-3.85 0 top  (outside the outline)
P8  7.59,123.78 0 top  (outside the outline)
P9  165.7,-3.85 0 top  (outside the outline)
P10  166.34,123.78 0 top  (outside the outline)
PB0  137.76,106.64 0 top
Q2  123.16,88.86 0 top
Q3  127.6,88.86 0 top
Q4  164.43,75.52 90 top
Q5  164.43,79.33 90 top
Q6  119.35,88.86 0 top
R1  161.89,75.52 90 top
R2  119.35,85.68 180 top
R3  136.11,88.86 90 top
R4  146.53,110.45 90 top
R5  137.76,104.73 180 top
R6  118.08,64.09 90 top
R7  117.83,94.57 90 top
R8  144.75,110.45 90 top
R9  166.97,75.52 90 top
R10  127.6,72.98 0 top
R11  159.99,97.11 180 top
R12  123.16,78.7 180 top
R13  123.16,80.41 0 top
R14  123.16,74.89 180 top
R15  100.3,81.24 0 top
R16  104.11,81.24 180 top
R17  105.38,71.71 0 top
R18  123.16,71.59 0 top
R19  123.16,73.24 0 top
R20  166.97,79.33 270 top
R21  161.89,79.21 270 top
R24  123.16,83.78 0 top
R26  123.16,85.68 180 top
R27  135.35,86.57 180 top
RSSI  105.38,69.81 0 top
RSSI_STATUS  105.76,73.62 270 bottom
RST  165.45,102.19 180 top
SOLAR  105.38,64.09 0 top
TF1  126.97,102.19 0 top
U1  145.41,101.58 180 top
U2  146.65,88.86 90 top
U3  132.05,88.86 180 top
U4  119.86,94.57 180 top
U5  127.6,76.16 90 top
U$23  [OSHW_FILLX200_NOTEXT]  155.54,90.76 0 bottom
U$24  [LOGO_SILK]  145.38,92.67 0 bottom
WIRELESS_PROGRAMMING  105.38,99.02 90 bottom
X2  152.37,87.59 270 top
X3  155.54,104.1 270 top

### Tracks (layer width: path | path; a pad name or v marks a point on that pad's centre or on a via)
3V3  (via drill 0.3 pad 0.64)
  Top 0.406: U1.6 v147.92,102.78 | v147.92,102.78 147.59,102.78 | 147.59,102.78 143.15,102.78 142.35,103.58 U1.18 139.41,103.58 C3.2 | U1.4 148.3,101.18 147.92,101.56 147.92,102.45 | 147.92,102.45 v147.92,102.78 | 147.59,102.78 147.92,102.45 | 147.92,102.45 148.18,102.7 | R11.2 v158.47,96.35
  Top 0.61: C3.2 138.65,102.32 137.89,101.56 136.42,101.56 135.85,100.99 v135.85,99.78 135.85,99.41 C14.+ 137.38,97.11 C13.2 C8.2 L2.2 137.38,90.89 R3.2 C4.2 | J1.5 133.39,66.06 131.92,67.52 129.83,67.52 J1.7 | 168.24,78.57 168.24,81.48 167.22,82.51 v157.45,82.51 D4.1 143.48,78.71 v143.48,72.98 | Q4.1 165.58,74.76 R9.1 167.23,74.76 168.24,75.78 168.24,78.57 | Q5.1 165.58,78.57 R20.2 168.24,78.57 | U4.5 120.49,93.73 C15.1 120.49,88.73 | 120.49,88.73 120.49,88.1 Q6.2 | v121.25,88.86 120.62,88.86 120.49,88.73 | v124.18,88.86 124.18,87.97 Q2.2
  Bottom 0.61: v147.92,102.78 147.92,98 149.58,96.35 v158.47,96.35 159.35,95.46 159.35,84.41 v157.45,82.51 | v121.25,88.86 v124.18,88.86 124.43,89.11 124.43,98.13 126.08,99.78 v135.85,99.78 | v143.48,72.98 139.67,69.17 131.48,69.17 J1.7
!INTA  (via drill 0.3 pad 0.64)
  Top 0.305: v147.92,89.49 U2.3
  Bottom 0.305: v147.92,89.49 147.29,90.13 147.29,104.35 152.62,109.69 154.53,109.69 P3.1
!INTB  (via drill 0.3 pad 0.64)
  Top 0.305: U2.7 145.38,88.22 v146.65,89.49
  Bottom 0.305: v146.65,89.49 146.65,104.61 152.5,110.45 153,110.45 P4.1
ADC6/CH_STATUS  (via drill 0.3 pad 0.64)
  Top 0.305: C5.1 R18.1 R19.1 R14.2 v121.64,74.89 | U1.19 140.13,102.78 v140.05,102.7
  Bottom 0.305: v121.64,74.89 121.64,79.59 125.57,83.52 125.57,97.49 126.46,98.38 138.65,98.38 139.42,99.14 139.42,102.07 v140.05,102.7
ADC7/LIPO_VOL  (via drill 0.3 pad 0.64)
  Top 0.305: R12.2 R13.1 C11.1 v122.4,81.24 | U1.22 139.76,100.38 v138.4,99.02
  Bottom 0.305: v138.4,99.02 126.33,99.02 125.06,97.75 125.06,83.9 v122.4,81.24
AT_RESET
  Top 0.305: C1.1 R11.1 | U1.29 145.81,96.18 147.42,94.57 159.74,94.57 | ICSP.3 159.99,90.25 159.99,94.32 | 159.99,94.57 159.99,94.83 | 159.99,94.83 159.99,96.35 R11.1 | 159.74,94.57 159.99,94.57 | J1.6 126.4,61.55 118.08,61.55 116.81,62.82 116.81,66.63 118.71,68.54 118.71,80.6 116.17,83.14 116.17,97.75 114.9,99.02 C19.2 | 159.74,94.57 159.99,94.83 | 159.74,94.57 159.99,94.32 | 159.99,94.32 159.99,94.57 | RST.1 RST.4 160.75,99.46 R11.1
  Bottom 0.305: ICSP.3 161.38,85.17 156.18,79.97 156.18,69.05 154.53,67.39 132.24,67.39 J1.6
BEE_3V3  (via drill 0.3 pad 0.64)
  Top 0.61: v117.44,89.87 Q6.3
  Bottom 0.61: v117.44,89.87 114.65,87.08 97.25,87.08 95.85,85.68 95.85,79.71 | BEE.1 95.65,79.13 | 95.65,79.13 J6.1 | 95.85,79.71 95.85,79.33 95.65,79.13 | 95.85,79.71 96.36,79.21
BEE_!CTS
  Top 0.305: J8.2 113,103.16 BEE.12
BEE_AD0
  Top 0.305: BEE.20 95.65,101.13 J8.10
BEE_AD1
  Top 0.305: J8.9 97.12,102.19 99.96,102.19 BEE.19
BEE_AD2
  Top 0.305: J8.8 99.03,102.83 101.33,102.83 BEE.18
BEE_AD3  (via drill 0.3 pad 0.64)
  Top 0.305: C19.1 v106.65,99.02 | J8.7 100.93,104.1 102.84,102.19 103.96,102.19 BEE.17
  Bottom 0.305: v106.65,99.02 WIRELESS_PROGRAMMING.1 WIRELESS_PROGRAMMING.2 105.03,99.05 BEE.17
BEE_AD4
  Top 0.305: J8.1 115.54,102.62 BEE.11
BEE_AD5
  Top 0.305: J8.5 106.06,104.1 BEE.15
BEE_AD6
  Top 0.305: J8.6 104.11,102.83 105.33,102.83 BEE.16
BEE_CD
  Top 0.305: BEE.4 105.03,79.11 103.35,77.43 101.57,77.43 J6.4
BEE_DTR
  Top 0.305: J6.9 113,77.1 BEE.9
BEE_RESET  (via drill 0.3 pad 0.64)
  Top 0.305: J6.5 104.11,77.43 105.33,77.43 BEE.5 | BEE_RST.4 BEE_RST.1 110.84,113.37 118.21,106 118.21,99.14 116.81,97.75 v116.81,83.78
  Bottom 0.305: v116.81,83.78 111.68,83.78 BEE.5
BEE_RSSI  (via drill 0.3 pad 0.64)
  Top 0.305: v106.14,72.73 R17.2 | J6.6 106.65,77.43 107.33,77.43 BEE.6
  Bottom 0.305: v106.14,72.73 RSSI_STATUS.2 RSSI_STATUS.1 J6.6
BEE_RXD
  Top 0.305: J6.3 99.03,77.43 100.3,77.43 100.93,78.06 101.96,78.06 BEE.3 103.35,79.45 R16.2
BEE_TXD
  Top 0.305: J6.2 97.12,78.06 99.96,78.06 BEE.2 101.06,79.16 R15.2
BEE_VREF
  Top 0.305: J8.4 108.06,104.1 BEE.14
BEES_RES0
  Top 0.305: J6.7 108.06,76.16 BEE.7
BEES_RES1
  Top 0.305: J6.8 110.46,76.56 BEE.8
C_VIN  (via drill 0.3 pad 0.64)
  Top 0.305: R6.2 v118.08,66 | U5.4 129.02,79.19
  Top 0.406: 129.02,79.19 C9.+ 128.89,79.34 v130.8,79.34
  Top 0.813: 128.89,79.34 128.89,81.52 D1.2 D2.2
  Bottom 0.305: v118.08,66 CH_STATUS.1
  Bottom 0.406: CH_STATUS.1 CH_STATUS.2 128.14,67.9 130.8,70.56 v130.8,79.34
  pour Top (isolate 0.254, no thermals): 128.75,76.79 129.38,76.79 129.38,79.33 128.75,79.33
CH
  Top 0.203: U5.7 125.45,75.91 125.19,75.65 125.19,71.71 | 125.19,71.71 125.19,71.59 | 125.19,71.46 125.19,68.16 CH.- | R18.2 125.06,71.59 | 125.06,71.59 125.19,71.59 | 125.06,71.59 125.19,71.71 | 125.06,71.59 125.19,71.46 | 125.19,71.46 125.19,71.59
D7  (via drill 0.3 pad 0.64)
  Top 0.305: R4.2 v146.53,111.97
  Bottom 0.305: v146.53,111.97 145.38,110.83 145.38,88.48 149.44,84.42 D7,8.1
D8  (via drill 0.3 pad 0.64)
  Top 0.305: R8.2 v144.75,111.97
  Bottom 0.305: v144.75,111.97 144.75,88.22 148.18,84.79 148.18,78.42 D7,8.2
DTR
  Top 0.305: C1.2 168.24,97.11 J2.1
GND  (via drill 0.3 pad 0.64)
  Top 0.305: U5.3 129.76,76.41 130.14,76.79
  Top 0.61: U3.2 v132.05,89.24
  other vias: 123.92,69.05 140.05,101.18 142.84,99.65 142.84,98.76 152.88,101.56 150.46,106.64 152.88,106.64 150.46,105.37 152.88,104.1 133.95,96.48 135.86,103.46 134.21,85.3 143.1,80.6 122.4,84.67 124.94,78.32 127.6,80.6 123.92,86.57 123.92,84.79 135.86,105.37 149.19,93.3 159.99,78.7 151.1,90.13 149.19,92.03 127.6,86.57 152.88,100.54 152.88,99.65 151.1,99.65 151.1,100.54 152.88,107.91 140.94,94.57 140.94,96.48 126.97,107.27 126.97,106 126.97,104.73 149.58,109.81 130.53,80.6 130.53,82.76 126.97,70.44 128.24,70.44 120.62,77.43 120.62,75.52 152.37,90.13 154.27,90.13 154.27,87.59 154.27,85.68 150.46,85.68 147.29,88.22 139.67,106.64 100.93,85.05 124.43,107.27 124.43,106 124.43,104.73 135.48,85.3 116.81,112.35 116.81,111.08 122.52,100.29 137,99.78 132.68,96.48 132.05,93.3 121.89,93.3 123.16,93.3 123.16,94.57 121.89,90.76 128.87,91.4 128.87,92.67 128.87,93.94 128.87,95.21 131.41,96.48 130.14,96.48 128.87,96.48 127.6,95.21 127.6,93.94 127.6,92.67 127.6,91.4 127.6,96.48 121.25,86.32 121.25,85.43 120.62,80.98 120.62,79.33 130.14,90.13 132.05,92.03 132.05,94.57 140.94,92.67 123.16,104.73 123.16,106 123.16,107.27 130.78,107.27 130.78,106 130.78,104.73 124.43,100.29
  pour Bottom (isolate 0.254, rank 6): 87.85,59.65 174.59,59.65 174.59,120.61 87.85,120.61
  pour Top (isolate 0.254, rank 6): 87.6,59.65 174.59,59.65 174.59,120.61 87.6,120.61
HSCL
  Top 0.305: I2C.1 158.38,79.97 R21.1 162.78,79.97 Q5.3
HSDA  (via drill 0.3 pad 0.64)
  Top 0.305: R1.1 162.66,74.76 Q4.3 v163.42,77.05
  Bottom 0.305: v163.42,77.05 157.68,77.05 I2C.2
LI_BAT  (via drill 0.3 pad 0.64)
  Top 0.305: U5.5 123.91,76.91 | v125.83,73.62 125.83,75.04 U5.8
  Top 0.406: 123.91,76.91 C20.2
  Top 0.813: C20.2 123.92,76.67 v123.92,75.78 R14.1 | 123.91,76.91 123.91,78.69 R12.1 | Q3.3 v126.33,89.87
  Bottom 0.813: 123.92,73.36 v123.92,75.78 123.92,78.82 126.33,81.24 v126.33,89.87 | 123.92,73.36 123.92,70.57 122.52,69.17 116.33,69.17 LIPO_BAT.1 | v125.83,73.62 124.43,73.62 | 124.43,73.62 124.18,73.62 123.92,73.36 | 124.43,73.62 124.05,74 124.05,73.24 124.43,73.62
  pour Top (isolate 0.254, no thermals): 126.46,76.79 126.46,77.43 123.79,77.43 123.79,76.79
N$1
  Top 0.305: R5.2 PB0.+
N$2
  Top 1.016: D4.2 D3.2 144,86.94 U2.8
N$3  (via drill 0.3 pad 0.64)
  Top 0.813: D1.1 v125.06,81.87
  Bottom 0.813: SOLAR.1 109.98,70.44 121.25,70.44 122.52,71.71 122.52,79.33 v125.06,81.87
N$4  (via drill 0.3 pad 0.64)
  Top 0.813: BAT1.+ v137.13,85.05 | v146.27,85.05 D3.1
  Bottom 0.813: v137.13,85.05 v146.27,85.05
N$5
  Top 0.305: U5.2 129.76,75.91 130.14,75.52 130.14,73.62 129.51,72.98 R10.2
N$6
  Top 0.305: R17.1 RSSI.+
N$7
  Top 0.305: X2.2 151.99,86.06 151.1,86.95 U2.1
N$8
  Top 0.305: R6.1 OK.+ CH.+
N$9
  Top 0.305: X2.1 151.99,89.11 151.1,88.22 U2.2
N$13
  Top 0.61: C4.1 133.54,88.1 U3.5 | R3.1 C4.1 | C4.1 R27.2
N$14  (via drill 0.3 pad 0.64)
  Top 0.305: R2.2 v118.59,86.57 118.59,87.71 Q6.1
  Bottom 0.305: P1.1 148.69,110.83 149.96,112.1 149.96,114.89 148.18,116.67 115.67,116.67 114.4,115.4 114.4,110.07 119.6,104.86 119.6,87.59 v118.59,86.57
N$15  (via drill 0.3 pad 0.64)
  Top 0.305: U5.HEAT v127.6,76.79
  Bottom 0.813: v127.6,76.79 v127.6,75.52
  pour Bottom (isolate 0.254): 128.87,74.38 126.33,74.38 arc-90 125.7,75.01 125.7,77.43 arc-90 126.33,78.06 128.87,78.06 arc-90 129.51,77.43 129.51,75.01 arc-90
N$16  (via drill 0.3 pad 0.64)
  Top 0.305: Q2.1 122.27,85.81 R26.2 121.13,84.41 118.08,84.41 117.44,85.05 v117.44,86.32
  Bottom 0.305: P2.1 151.23,110.83 152.5,112.1 152.5,115.15 150.46,117.18 115.41,117.18 113.89,115.65 113.89,109.81 119.1,104.61 119.1,87.97 v117.44,86.32
N$17
  Top 0.61: L2.1 135.61,91.78 133.32,91.78 133.32,92.97 L1.2
N$18
  Top 0.61: U3.3 131.1,92.65 L1.1
N$19
  Top 0.305: R7.1 119.14,93.81 U4.4
OK
  Top 0.203: U5.6 125.19,76.41 124.81,76.03 124.81,74.13 R19.2 123.16,72.47 123.16,68.03 OK.-
ON/!SLEEP
  Top 0.305: J8.3 110.46,103.7 BEE.13
PB0
  Top 0.305: U1.12 145.81,108.63 R8.1 140.18,114.26 J4.1
PB1/CS2
  Top 0.305: U1.13 145.01,107.9 140.18,112.73 138.59,112.73 J4.2
PB2/CS1  (via drill 0.3 pad 0.64)
  Top 0.305: U1.14 144.21,107.64 v140.71,111.13 139.62,112.23 136.55,112.23 J4.3 | v129.13,109.81 129.13,102.5 TF1.2 | U4.1 120.51,95.98 v121.25,96.73
  Bottom 0.305: v140.71,111.13 130.45,111.13 v129.13,109.81 122.56,109.81 121.25,108.5 v121.25,96.73
PB3/MOSI  (via drill 0.3 pad 0.64)
  Top 0.305: v148.56,104.73 143.61,104.73 143.41,104.93 U1.15 143.41,107.35 141.32,109.43 v140.94,109.81 139.03,111.72 134.52,111.72 J4.4 | TF1.3 127.97,108.53 v127.99,108.54
  Bottom 0.305: ICSP.5 162.66,92.66 162.66,95.21 159.48,98.38 150.34,98.38 149.83,98.89 149.83,103.97 149.07,104.73 v148.56,104.73 | v127.99,108.54 129.76,108.54 131.03,109.81 v140.94,109.81
PB4/MISO  (via drill 0.3 pad 0.64)
  Top 0.305: J4.5 132.49,111.21 138.54,111.21 v139.24,110.51 142.61,107.14 U1.16 142.61,104.97 143.48,104.1 v147.92,104.1 | R7.2 121.25,98.76 121.25,108.54 121.89,109.18 v123.16,109.18
  Bottom 0.305: v139.24,110.51 130.84,110.51 129.51,109.18 v123.16,109.18 | v147.92,104.1 148.81,104.1 149.19,103.72 149.19,98.64 150.08,97.75 159.09,97.75 161.38,95.46 ICSP.1
PB5/SCK  (via drill 0.3 pad 0.64)
  Top 0.305: U1.17 142.44,104.38 143.35,103.46 v148.56,103.46 | U1.17 138.88,104.38 R5.1 | U1.17 141.11,107.61 138.03,110.7 v125.76,110.7 | TF1.5 125.77,110.27 125.77,110.63 v125.77,110.69 v125.76,110.7 | v125.76,110.7 125.76,113.12 J4.6
  Bottom 0.305: ICSP.2 160.12,92.67 160.12,95.72 158.72,97.11 149.83,97.11 148.56,98.38 v148.56,103.46 | D13_LED.2 D13_LED.1 v125.76,110.7
PC0
  Top 0.305: U1.23 139.82,99.58 139.03,98.79 139.03,71.06 141.56,68.54 146.14,68.54 J3.1
PC1
  Top 0.305: U1.24 140.07,98.78 139.67,98.38 139.67,71.34 141.83,69.17 148.05,69.17 J3.2
PC2
  Top 0.305: U1.25 142.61,92.3 140.3,90 140.3,71.61 142.11,69.81 149.95,69.81 J3.3
PC3
  Top 0.305: U1.26 143.41,92.21 140.94,89.75 140.94,71.88 142.38,70.44 151.86,70.44 J3.4
PC4/SDA  (via drill 0.3 pad 0.64)
  Top 0.305: J3.5 153.76,71.08 142.67,71.08 141.57,72.17 141.57,89.49 142.84,90.76 U2.5 144.21,90.98 U1.27 144.21,99.53 v144.08,99.65 | R9.2 165.58,76.28 Q4.2 v164.43,76.41
  Bottom 0.305: J4.9 121.19,112.35 141.83,112.35 143.48,110.7 143.48,100.25 v144.08,99.65 | v164.43,76.41 160.12,76.41 158.85,75.14 J3.5
PC5/SCL  (via drill 0.3 pad 0.64)
  Top 0.305: J3.6 155.67,71.71 142.89,71.71 142.21,72.4 142.21,88.86 142.84,89.49 U2.6 145.38,89.49 146.02,90.13 146.02,95.21 145.01,96.22 U1.28 145.01,100.03 144.37,100.67 v142.84,100.67 | Q5.2 165.58,80.09 v166.34,80.09 R20.1
  Bottom 0.305: J3.6 159.35,68.03 159.35,74.89 160.24,75.78 165.25,75.78 166.34,76.87 v166.34,80.09 | v142.84,100.67 142.84,110.32 141.32,111.84 119.15,111.84 J4.10
PD0/RXD  (via drill 0.3 pad 0.64)
  Top 0.305: J5.1 159.48,112.36 v159.48,104.73 159.48,99.06 155.63,95.21 147.67,95.21 146.61,96.27 U1.30 | R15.1 v98.39,81.24
  Bottom 0.305: J2.3 161.26,99.02 161.26,102.95 v159.48,104.73 | J5.1 157.45,118.19 114.9,118.19 112.87,116.16 112.87,109.3 118.08,104.1 118.08,88.73 115.67,86.32 100.93,86.32 99.54,84.92 P6.MM P6.11 98.39,83.02 v98.39,81.24
PD1/TXD  (via drill 0.3 pad 0.64)
  Top 0.305: J5.2 v158.84,106.38 158.84,99.27 155.41,95.84 147.92,95.84 147.41,96.36 U1.31 | R16.1 v106.01,81.24 v106.01,85.68
  Bottom 0.305: J2.2 167.23,93.94 161.89,99.27 161.89,103.33 v158.84,106.38 | P5.11 P5.MM 106.01,83.02 v106.01,81.24 | J5.2 155.42,117.69 115.16,117.69 113.38,115.91 113.38,109.56 118.59,104.35 118.59,88.35 115.92,85.68 v106.01,85.68
PD2
  Top 0.305: U1.32 155.98,97.29 158.21,99.52 158.21,112.35 J5.3
  Bottom 0.305: P3.2 J5.3
PD3
  Top 0.305: U1.1 156.58,98.78 157.58,99.78 157.58,110.44 J5.4
  Bottom 0.305: J5.4 P4.2
PD4  (via drill 0.3 pad 0.64)
  Top 0.305: U1.2 147.36,99.58 v146.02,100.92
  Bottom 0.305: v146.02,100.92 146.02,104.86 150.46,109.3 150.46,110.57 P2.2 150.46,113.5 J5.5
PD5
  Top 0.305: U1.9 148.21,113.78 J5.6
  Bottom 0.305: J5.6 147.92,113.5 P1.2
PD6
  Top 0.305: U1.10 147.41,112.99 J5.7
  Bottom 0.305: J5.7 144.24,116.16 115.92,116.16 114.9,115.15 114.9,110.32 120.11,105.11 120.11,87.16 118,85.05 102.71,85.05 P6.00
PD7
  Top 0.305: U1.11 146.61,109.61 R4.1 145.64,110.57 145.64,112.23 145.63,112.23 J5.8
  Bottom 0.305: J5.8 142.21,115.65 116.17,115.65 115.41,114.89 115.41,110.57 120.62,105.37 120.62,86.95 118.21,84.54 108.81,84.54 P5.00
SD_SO
  Top 0.305: TF1.7 123.57,100.06 119.86,96.35 U4.2
TF_3V3
  Top 0.61: Q2.3 124.05,90.76 C12.2 124.18,92.16 124.18,96.35 126.87,99.04 TF1.4
USB5V  (via drill 0.3 pad 0.64)
  Top 0.813: R24.2 D2.1 | D2.1 D5.1 125.97,87.1 Q3.1 | v146.27,83.78 163.8,83.78 J2.4 | D2.1 v127.99,83.78
  Bottom 0.813: J2.4 168.88,88.98 ICSP.6 | v146.27,83.78 v127.99,83.78
V_REF  (via drill 0.3 pad 0.64)
  Top 0.305: v144.11,101.56 143.69,101.98 U1.20 139.96,101.98 C2.2
  Bottom 0.305: v144.11,101.56 144.11,111.08 142.46,112.73 142.46,112.74 142.34,112.86 123.22,112.86 J4.8
VCC  (via drill 0.3 pad 0.64)
  Top 0.305: 131.16,87.62 U3.4 131.1,88.42 131.29,88.6 132.56,88.6 133,89.05 U3.1
  Top 0.61: C10.2 131.1,85.74 | R21.2 R1.2
  Top 0.813: Q3.2 129.24,87.1 D5.2 C10.2 131.16,84.03 132.68,82.51 132.68,69.24 v133.67,68.25 134.02,67.9 J1.4 | U3.4 131.1,85.74 | D7,8.3 I2C.3 158.7,76.28 R1.2
  Bottom 0.813: D7,8.3 147.56,75.16 140.62,68.22 133.7,68.22 v133.67,68.25
XTAL1
  Top 0.305: U1.7 151.11,103.58 C6.2 154.27,102.95 X3.2
XTAL2
  Top 0.305: U1.8 150.87,104.38 C7.2 154.27,105.24 X3.1

### Text on the board
tPlace: PWM | PWM | PWM | PWM | PWM | PWM | TXD | RXD | SCL | SDA | AREF | GND | 13 | 12 | 11 | 10 | 9 | 8 | 7 | 6 | 5 | 4 | 3 | 2 | 1 | 0 | DTR | 5V | MISO | TXD | RXD | SCK | MOSI | 5V | RST | GND | GND | GND | D7 | SCL | D8 | SDA | RVIN | RVIN | GND | GND | SDA | SCL | NC | NC | A0 | A1 | A2 | A3 | A4 | A5 | 3V3 | VCC | GND | GND | IOREF | RESET
bPlace: Seeeduino Stalker | v3.0 03/14/2014 | by Seeed Studio | www.seeedstudio.com